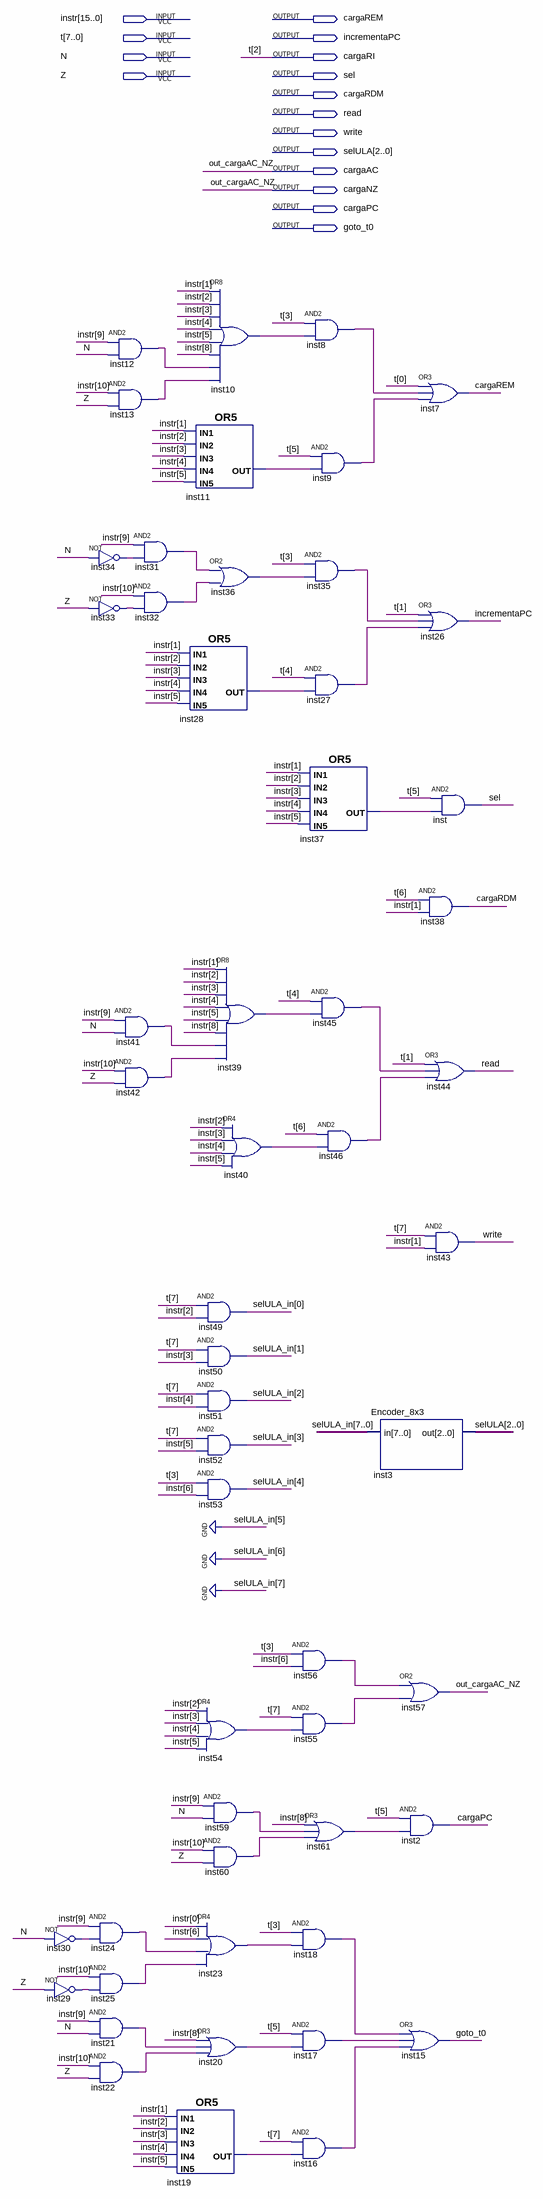
[diagram p0: schematic sheet]
// Quartus schematic ControlUnit.bdf as structural Verilog: 54 symbols, 16 pins
module ControlUnit (
  input  [15:0] instr,
  input  [7:0] t,
  input  N,
  input  Z,
  output cargaREM,
  output incrementaPC,
  output cargaRI,
  output sel,
  output cargaRDM,
  output read,
  output write,
  output [2:0] selULA,
  output cargaAC,
  output cargaNZ,
  output cargaPC,
  output goto_t0
);

  wire inst8_out, inst9_out, inst10_out, inst11_out, inst12_out, inst13_out, inst16_out, inst17_out,
       inst18_out, inst19_out, inst20_out, inst21_out, inst22_out, inst23_out, inst24_out, inst25_out,
       inst27_out, inst28_out, inst29_out, inst30_out, inst31_out, inst32_out, inst33_out, inst34_out,
       inst35_out, inst36_out, inst37_out, inst39_out, inst40_out, inst41_out, inst42_out, inst45_out,
       inst46_out, inst54_out, inst55_out, inst56_out, inst59_out, inst60_out, inst61_out;
  wire [4:0] selULA_in;

  not inst30 (inst30_out, N);
  not inst29 (inst29_out, Z);
  and inst12 (inst12_out, instr[9], N);
  and inst13 (inst13_out, instr[10], Z);
  not inst34 (inst34_out, N);
  not inst33 (inst33_out, Z);
  and inst24 (inst24_out, instr[9], inst30_out);
  and inst25 (inst25_out, instr[10], inst29_out);
  and inst21 (inst21_out, instr[9], N);
  and inst22 (inst22_out, instr[10], Z);
  and inst31 (inst31_out, instr[9], inst34_out);
  and inst32 (inst32_out, instr[10], inst33_out);
  and inst41 (inst41_out, instr[9], N);
  and inst42 (inst42_out, instr[10], Z);
  or inst10 (inst10_out, instr[1], instr[2], instr[3], instr[4], instr[5], instr[8], inst12_out, inst13_out);
  or inst11 (inst11_out, instr[1], instr[2], instr[3], instr[4], instr[5]);
  or inst36 (inst36_out, inst31_out, inst32_out);
  or inst28 (inst28_out, instr[1], instr[2], instr[3], instr[4], instr[5]);
  and inst49 (selULA_in[0], t[7], instr[2]);
  and inst50 (selULA_in[1], t[7], instr[3]);
  and inst51 (selULA_in[2], t[7], instr[4]);
  and inst52 (selULA_in[3], t[7], instr[5]);
  and inst53 (selULA_in[4], t[3], instr[6]);
  or inst54 (inst54_out, instr[2], instr[3], instr[4], instr[5]);
  and inst59 (inst59_out, instr[9], N);
  and inst60 (inst60_out, instr[10], Z);
  or inst23 (inst23_out, instr[0], instr[6], inst24_out, inst25_out);
  or inst20 (inst20_out, instr[8], inst21_out, inst22_out);
  or inst19 (inst19_out, instr[1], instr[2], instr[3], instr[4], instr[5]);
  or inst39 (inst39_out, instr[1], instr[2], instr[3], instr[4], instr[5], instr[8], inst41_out, inst42_out);
  or inst40 (inst40_out, instr[2], instr[3], instr[4], instr[5]);
  and inst8 (inst8_out, t[3], inst10_out);
  and inst9 (inst9_out, t[5], inst11_out);
  and inst35 (inst35_out, t[3], inst36_out);
  and inst27 (inst27_out, t[4], inst28_out);
  or inst37 (inst37_out, instr[1], instr[2], instr[3], instr[4], instr[5]);
  and inst45 (inst45_out, t[4], inst39_out);
  and inst56 (inst56_out, t[3], instr[6]);
  and inst55 (inst55_out, t[7], inst54_out);
  or inst61 (inst61_out, instr[8], inst59_out, inst60_out);
  and inst18 (inst18_out, t[3], inst23_out);
  and inst17 (inst17_out, t[5], inst20_out);
  and inst16 (inst16_out, t[7], inst19_out);
  and inst46 (inst46_out, t[6], inst40_out);
  Encoder_8x3 inst3 (.in({3'b000, selULA_in}), .out(selULA));
  or inst57 (cargaAC, inst56_out, inst55_out);
  and inst2 (cargaPC, t[5], inst61_out);
  or inst15 (goto_t0, inst18_out, inst17_out, inst16_out);
  or inst7 (cargaREM, t[0], inst8_out, inst9_out);
  or inst26 (incrementaPC, t[1], inst35_out, inst27_out);
  and inst (sel, t[5], inst37_out);
  and inst38 (cargaRDM, t[6], instr[1]);
  or inst44 (read, t[1], inst45_out, inst46_out);
  and inst43 (write, t[7], instr[1]);

  assign cargaNZ = cargaAC;
  assign cargaRI = t[2];

  // Other names for the same wires on the sheet: out_cargaAC_NZ = cargaAC
endmodule
